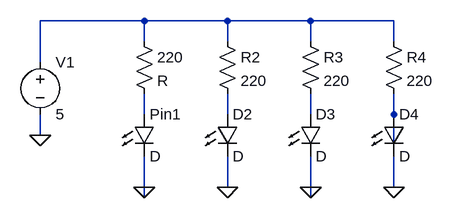
[diagram p0: schematic Arduino_Schematic.asc]
Arduino_Schematic.asc, the LTspice schematic file:
Version 4
SHEET 1 972 680
WIRE 176 64 16 64
WIRE 304 64 176 64
WIRE 432 64 304 64
WIRE 560 64 432 64
WIRE 176 96 176 64
WIRE 304 96 304 64
WIRE 432 96 432 64
WIRE 560 96 560 64
WIRE 16 128 16 64
WIRE 176 208 176 176
WIRE 304 208 304 176
WIRE 432 208 432 176
WIRE 560 208 560 176
WIRE 16 240 16 208
WIRE 560 256 560 208
WIRE 176 320 176 272
WIRE 304 320 304 272
WIRE 432 320 432 272
WIRE 560 320 560 272
WIRE 176 336 176 320
WIRE 432 336 432 320
FLAG 16 240 0
FLAG 176 320 0
FLAG 304 320 0
FLAG 432 320 0
FLAG 560 320 0
SYMBOL LED 160 208 R0
SYMATTR InstName Pin1
SYMBOL voltage 16 112 R0
WINDOW 123 0 0 Left 0
WINDOW 39 0 0 Left 0
SYMATTR InstName V1
SYMATTR Value 5
SYMBOL LED 288 208 R0
SYMATTR InstName D2
SYMBOL LED 416 208 R0
SYMATTR InstName D3
SYMBOL LED 544 208 R0
SYMATTR InstName D4
SYMBOL res 160 80 R0
SYMATTR InstName 220
SYMBOL res 288 80 R0
SYMATTR InstName R2
SYMATTR Value 220
SYMBOL res 416 80 R0
SYMATTR InstName R3
SYMATTR Value 220
SYMBOL res 544 80 R0
SYMATTR InstName R4
SYMATTR Value 220

The netlist it stands for:
* Arduino_Schematic.asc
D§Pin1 N002 0 D
V1 N001 0 5
D2 N003 0 D
D3 N004 0 D
D4 N005 0 D
R§220 N001 N002 R
R2 N001 N003 220
R3 N001 N004 220
R4 N001 N005 220
.model D D
.lib standard.dio
.backanno
.end